# Altium schematic sheet drivers.SchDoc
size A1
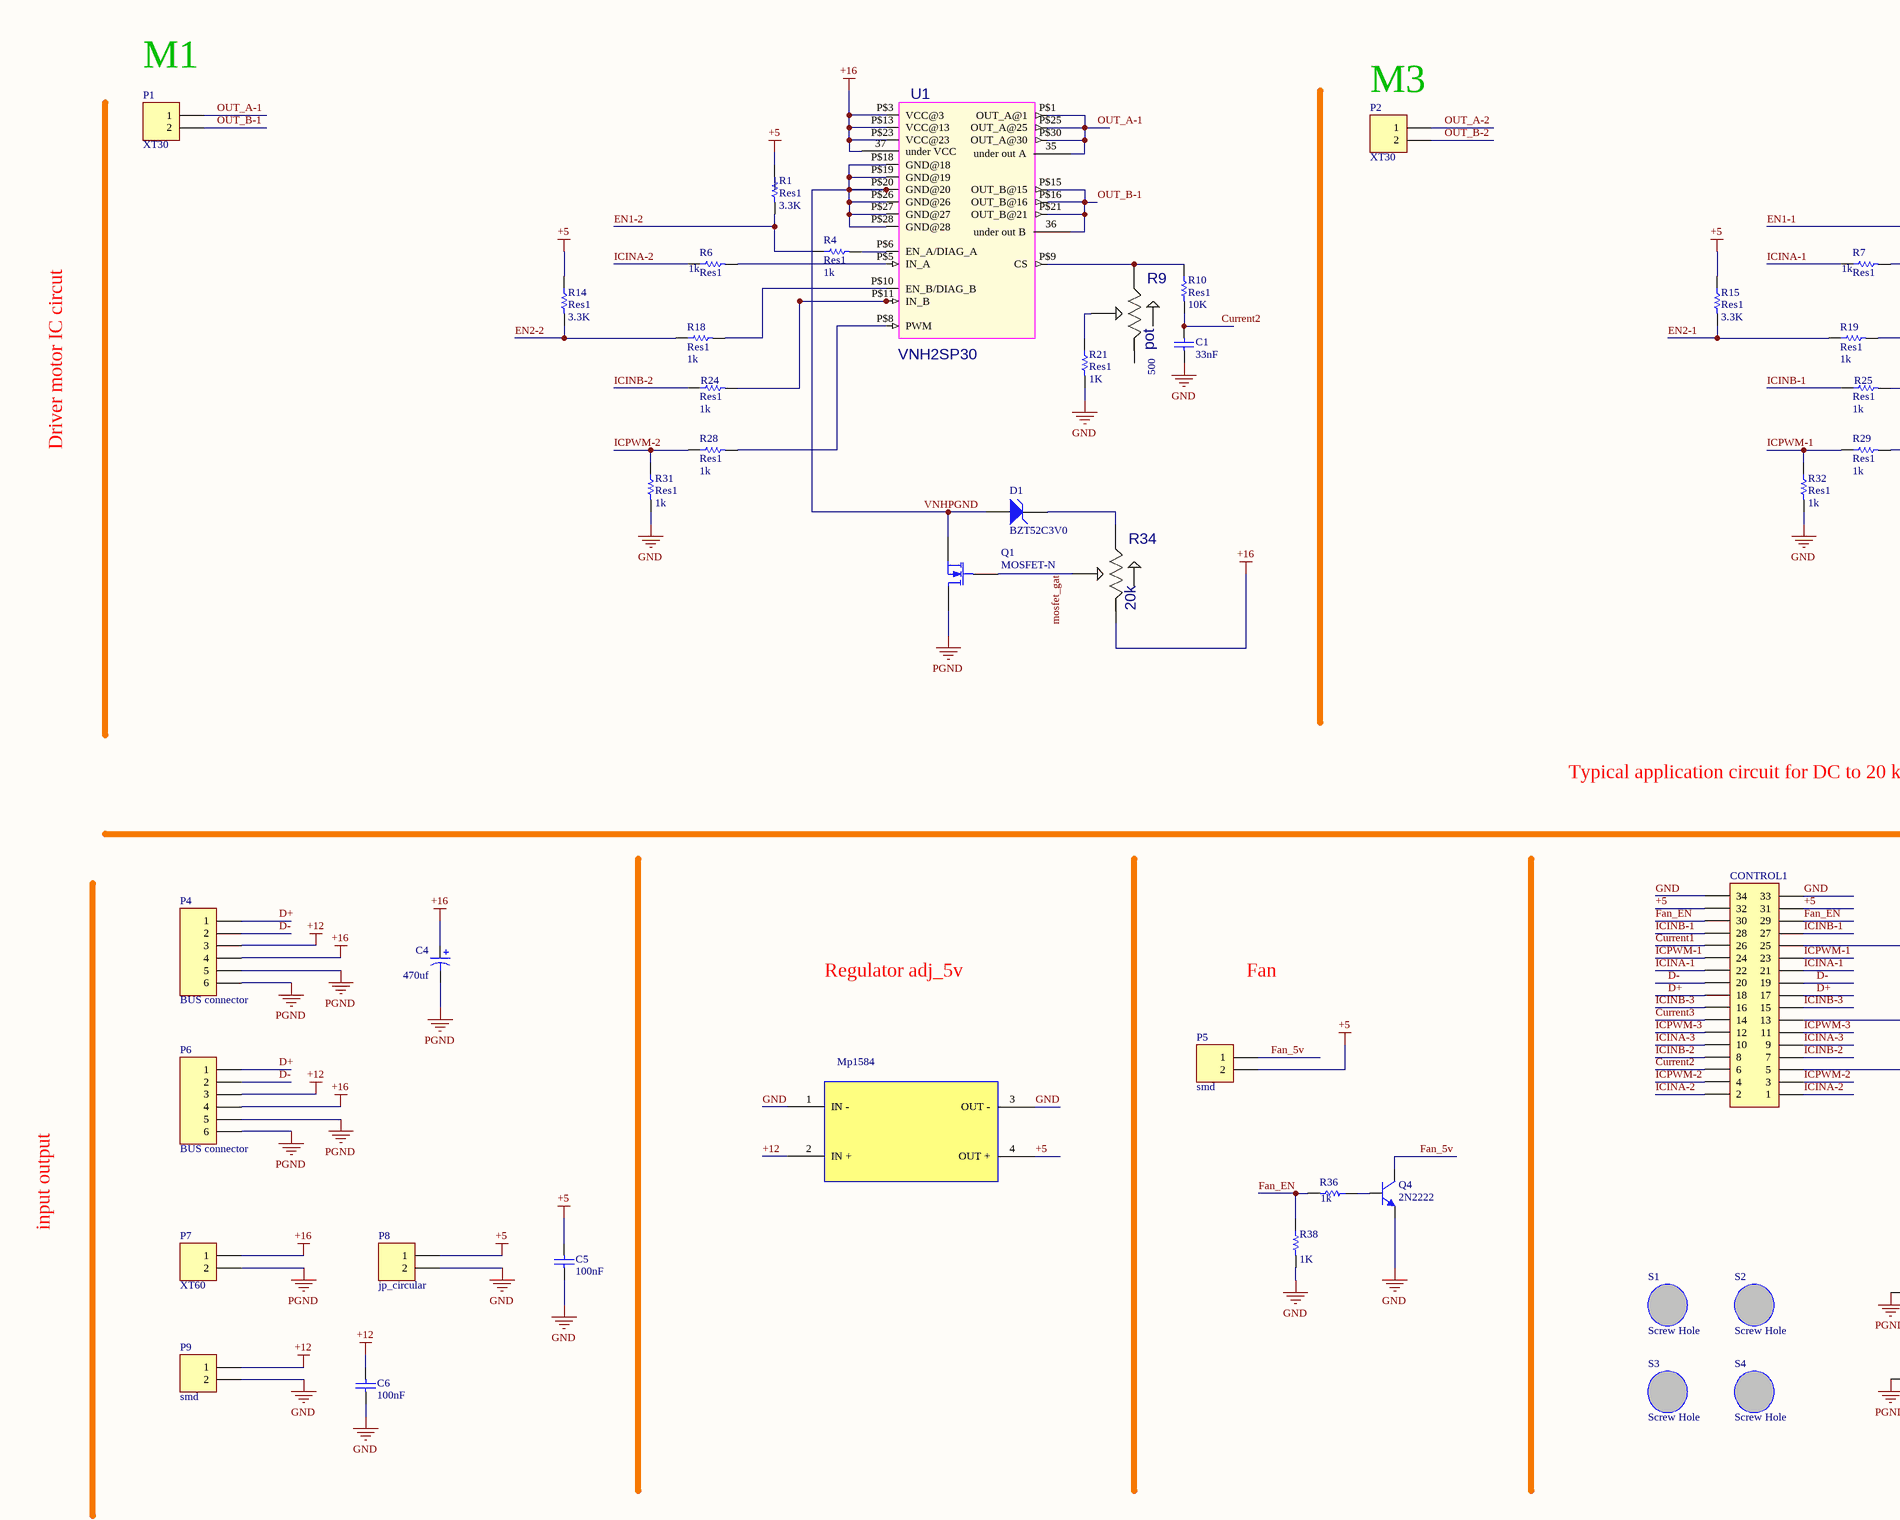
[diagram p0: drivers.SchDoc, left]
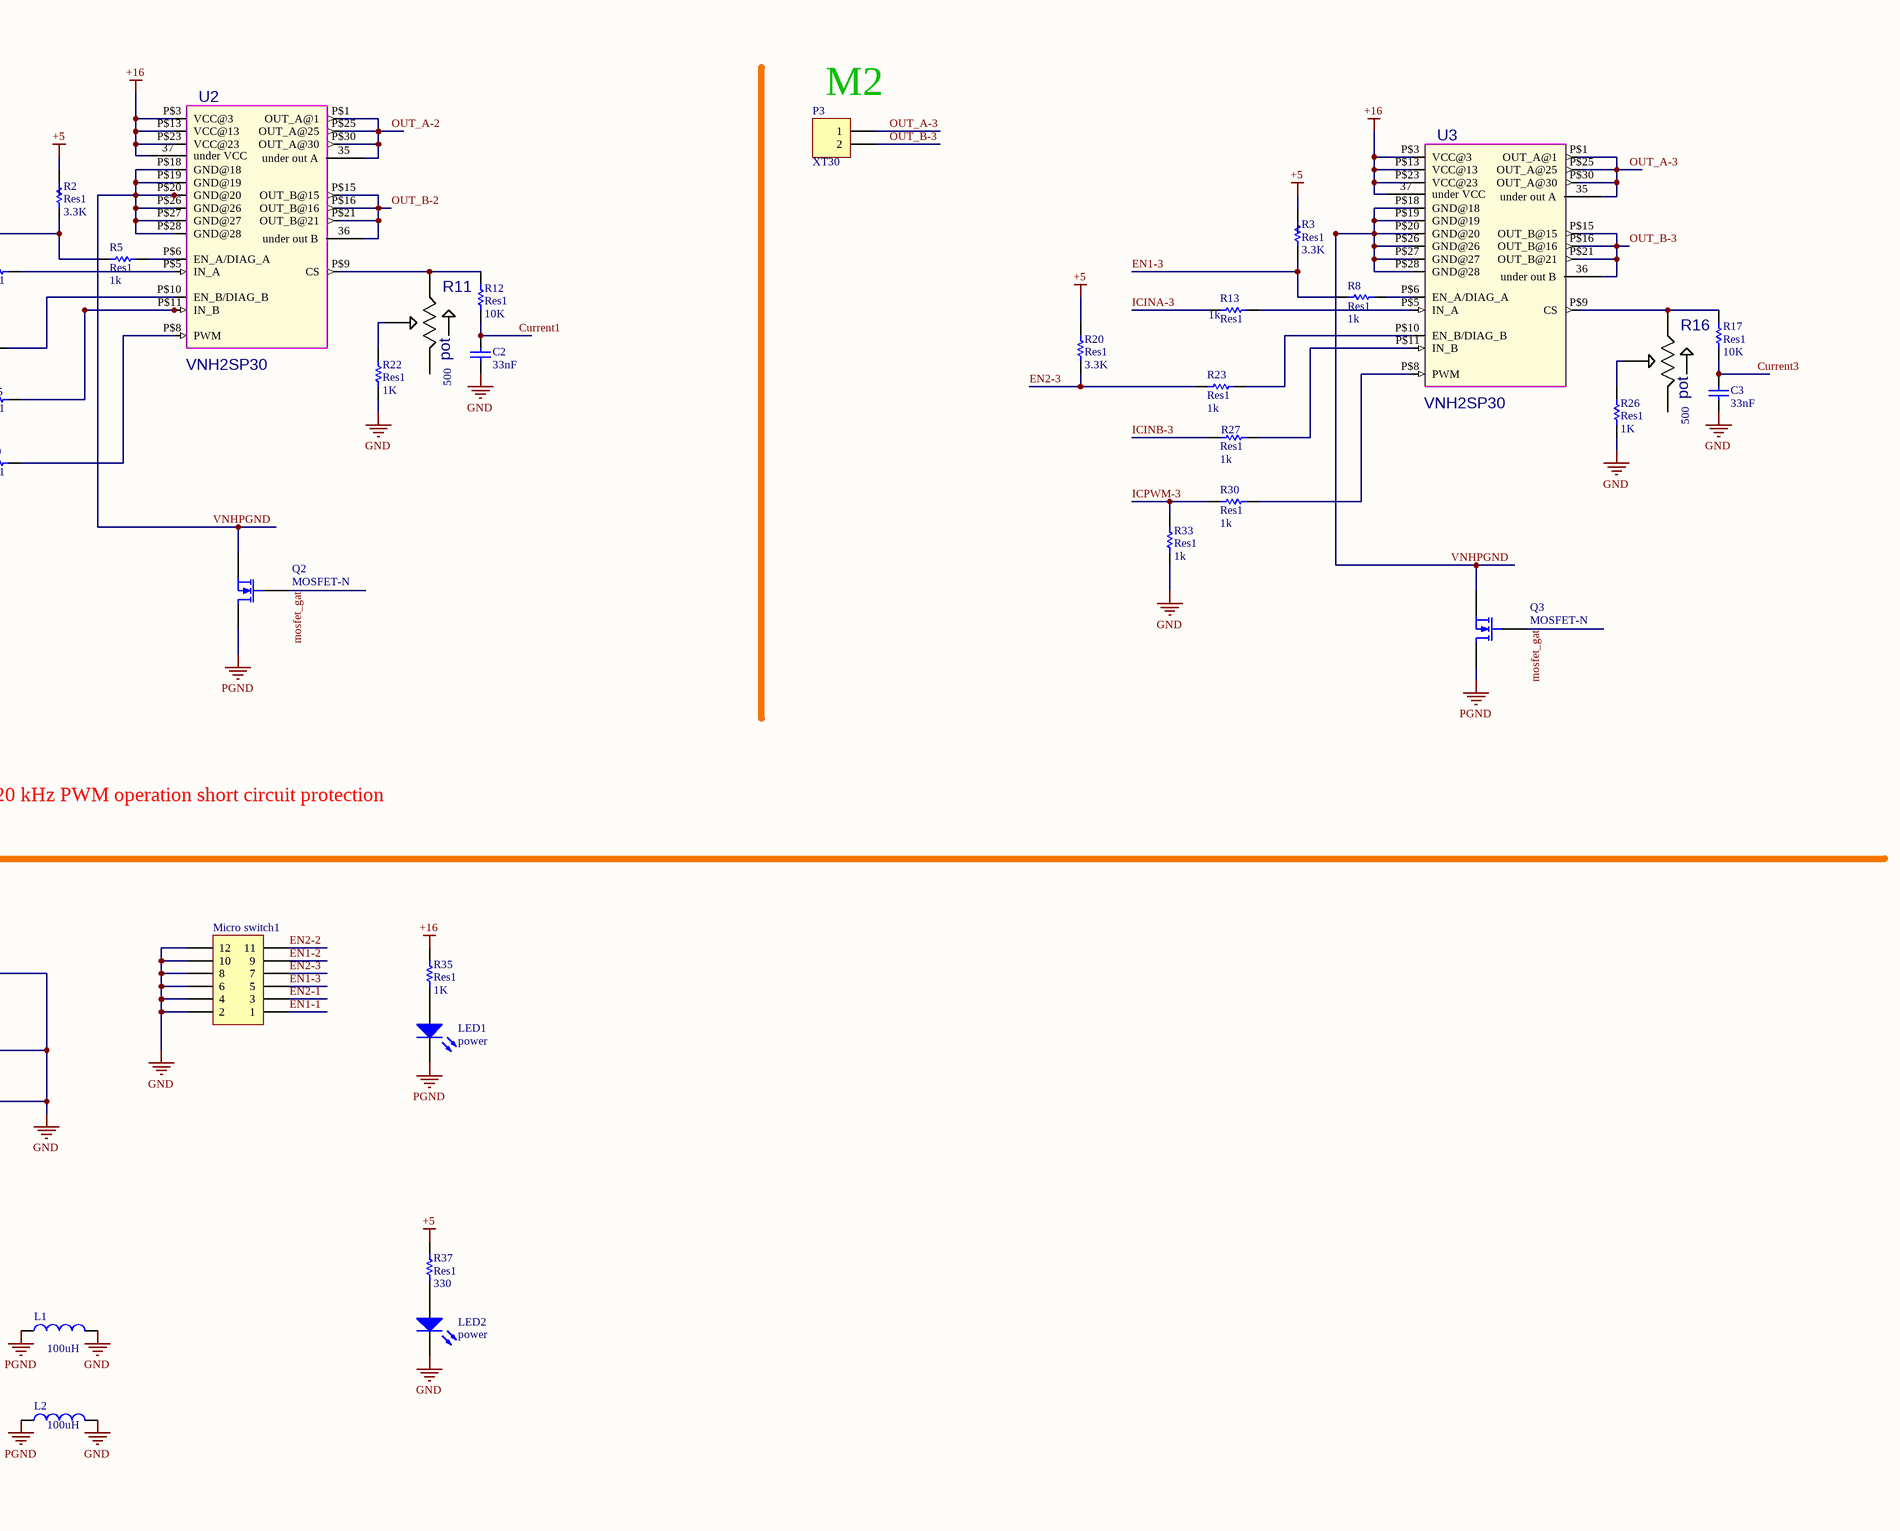
[diagram p1: drivers.SchDoc, right]

## Parts
C1  33nF  [J1-0603]
C2  33nF  [J1-0603]
C3  33nF  [J1-0603]
C4  value 470uf  [CAP 470uf sleep smd]  (hidden comment: Cap Pol1)
C5  100nF  [J1-0603]
C6  100nF  [J1-0603]
CONTROL1  (no value)  [HDR2X17H]
D1  BZT52C3V0  [SOD123]
L1  value 100uH  [2012[0805]]
L2  value 100uH  [2012[0805]]
LED1  power  [3518]
LED2  power  [3518]
Micro_switch1  (no value)  [HDR2X6H]
Mp1  Mp1584  [mp1584-1.8]
P1  XT30  [xt-30]
P2  XT30  [xt-30]
P3  XT30  [xt-30]
P4  BUS connector  [CON6-TIWAN]
P5  smd  [sheader 2]
P6  BUS connector  [con6-tiwan]
P7  XT60  [XT-60]
P8  jp_circular  [JP circular 2]
P9  smd  [sheader 2]
Q1  MOSFET-N  [D-pack]
Q2  MOSFET-N  [D-pack]
Q3  MOSFET-N  [D-pack]
Q4  2N2222  [SOT-23]
R1  Res1  value 3.3K  [j1-0603]
R2  Res1  value 3.3K  [j1-0603]
R3  Res1  value 3.3K  [j1-0603]
R4  Res1  value 1k  [j1-0603]
R5  Res1  value 1k  [j1-0603]
R6  Res1  value 1k  [j1-0603]
R7  Res1  value 1k  [j1-0603]
R8  Res1  value 1k  [j1-0603]
R9  pot  value 500  [35WR_TC33X-2-103E(Primary)]
R10  Res1  value 10K  [j1-0603]
R11  pot  value 500  [35WR_TC33X-2-103E(Primary)]
R12  Res1  value 10K  [j1-0603]
R13  Res1  value 1k  [j1-0603]
R14  Res1  value 3.3K  [j1-0603]
R15  Res1  value 3.3K  [j1-0603]
R16  pot  value 500  [35WR_TC33X-2-103E(Primary)]
R17  Res1  value 10K  [j1-0603]
R18  Res1  value 1k  [j1-0603]
R19  Res1  value 1k  [j1-0603]
R20  Res1  value 3.3K  [j1-0603]
R21  Res1  value 1K  [j1-0603]
R22  Res1  value 1K  [j1-0603]
R23  Res1  value 1k  [j1-0603]
R24  Res1  value 1k  [j1-0603]
R25  Res1  value 1k  [j1-0603]
R26  Res1  value 1K  [j1-0603]
R27  Res1  value 1k  [j1-0603]
R28  Res1  value 1k  [j1-0603]
R29  Res1  value 1k  [j1-0603]
R30  Res1  value 1k  [j1-0603]
R31  Res1  value 1k  [j1-0603]
R32  Res1  value 1k  [j1-0603]
R33  Res1  value 1k  [j1-0603]
R34  20k  [35WR_TC33X-2-103E(Primary)]
R35  Res1  value 1K  [j1-0603]
R36  value 1k  [j1-0603]
R37  Res1  value 330  [j1-0603]
R38  value 1K  [j1-0603]
S1  Screw Hole  [Screw Holw 3-6 mm]
S2  Screw Hole  [Screw Holw 3-6 mm]
S3  Screw Hole  [Screw Holw 3-6 mm]
S4  Screw Hole  [Screw Holw 3-6 mm]
U1  VNH2SP30  [MULTIPOWER30_VNH2SP30(Primary)]
U2  VNH2SP30  [MULTIPOWER30_VNH2SP30(Primary)]
U3  VNH2SP30  [MULTIPOWER30_VNH2SP30(Primary)]

## Nets
+5: C5.2 CONTROL1.31 CONTROL1.32 Mp1.4(OUT_+) P5.2 P8.1 R1.1 R2.1 R3.1 R14.1 R15.1 R20.1 R37.1
+12: C6.2 Mp1.2(IN_+) P4.3 P6.3 P9.1
+16: C4.1 P4.4 P6.4 P7.1 R34.1 R35.1 U1.37(under_VCC) U1.P$3(VCC@3) U1.P$13(VCC@13) U1.P$23(VCC@23) U2.37(under_VCC) U2.P$3(VCC@3) U2.P$13(VCC@13) U2.P$23(VCC@23) U3.37(under_VCC) U3.P$3(VCC@3) U3.P$13(VCC@13) U3.P$23(VCC@23)
GND: C1.1 C2.1 C3.1 C5.1 C6.1 CONTROL1.5 CONTROL1.13 CONTROL1.25 CONTROL1.33 CONTROL1.34 L1.2 L2.2 LED2.2(K) Micro_switch1.2 Micro_switch1.4 Micro_switch1.6 Micro_switch1.8 Micro_switch1.10 Micro_switch1.12 Mp1.1(IN_-) Mp1.3(OUT_-) P8.2 P9.2 Q4.3(E) R21.2 R22.2 R26.2 R31.2 R32.2 R33.2 R38.2
PGND: C4.2 L1.1 L2.1 LED1.2(K) P4.5 P4.6 P6.5 P6.6 P7.2 Q1.2(D) Q2.2(D) Q3.2(D)
Current1: C2.2 CONTROL1.26 R12.2
Current2: C1.2 CONTROL1.6 R10.2
Current3: C3.2 CONTROL1.14 R17.2
D+: CONTROL1.17 CONTROL1.18 P4.1 P6.1
D-: CONTROL1.19 CONTROL1.20 P4.2 P6.2
EN1-1: D1.1(A) Micro_switch1.1 Micro_switch1.5 Micro_switch1.9 Q1.3(S) Q2.3(S) Q3.3(S) R1.2 R2.2 R3.2 R4.1 R5.1 R8.1 U1.P$18(GND@18) U1.P$19(GND@19) U1.P$20(GND@20) U1.P$26(GND@26) U1.P$27(GND@27) U1.P$28(GND@28) U2.P$18(GND@18) U2.P$19(GND@19) U2.P$20(GND@20) U2.P$26(GND@26) U2.P$27(GND@27) U2.P$28(GND@28) U3.P$18(GND@18) U3.P$19(GND@19) U3.P$20(GND@20) U3.P$26(GND@26) U3.P$27(GND@27) U3.P$28(GND@28)  [also labelled EN1-2, EN1-3, VNHPGND]
EN2-1: Micro_switch1.3 R15.2 R19.1
EN2-2: Micro_switch1.11 R14.2 R18.1
EN2-3: Micro_switch1.7 R20.2 R23.1
Fan_5v: P5.1 Q4.1(C)
Fan_EN: CONTROL1.29 CONTROL1.30 R36.2 R38.1
ICINA-1: CONTROL1.21 CONTROL1.22 R7.1
ICINA-2: CONTROL1.1 CONTROL1.2 R6.1
ICINA-3: CONTROL1.9 CONTROL1.10 R13.1
ICINB-1: CONTROL1.27 CONTROL1.28 R25.1
ICINB-2: CONTROL1.7 CONTROL1.8 R24.1
ICINB-3: CONTROL1.15 CONTROL1.16 R27.1
ICPWM-1: CONTROL1.23 CONTROL1.24 R29.1 R32.1
ICPWM-2: CONTROL1.3 CONTROL1.4 R28.1 R31.1
ICPWM-3: CONTROL1.11 CONTROL1.12 R30.1 R33.1
mosfet_gat: Q1.1(G) Q2.1(G) Q3.1(G) R34.2
OUT_A-1: P1.1 U1.35(under_out_A) U1.P$1(OUT_A@1) U1.P$25(OUT_A@25) U1.P$30(OUT_A@30)
OUT_A-2: P2.1 U2.35(under_out_A) U2.P$1(OUT_A@1) U2.P$25(OUT_A@25) U2.P$30(OUT_A@30)
OUT_A-3: P3.1 U3.35(under_out_A) U3.P$1(OUT_A@1) U3.P$25(OUT_A@25) U3.P$30(OUT_A@30)
OUT_B-1: P1.2 U1.36(under_out_B) U1.P$15(OUT_B@15) U1.P$16(OUT_B@16) U1.P$21(OUT_B@21)
OUT_B-2: P2.2 U2.36(under_out_B) U2.P$15(OUT_B@15) U2.P$16(OUT_B@16) U2.P$21(OUT_B@21)
OUT_B-3: P3.2 U3.36(under_out_B) U3.P$15(OUT_B@15) U3.P$16(OUT_B@16) U3.P$21(OUT_B@21)
NetD1_2: D1.2(K) R34.3
NetLED1_1: LED1.1(A) R35.2
NetLED2_1: LED2.1(A) R37.2
NetQ4_2: Q4.2(B) R36.1
NetR4_2: R4.2 U1.P$6(EN_A/DIAG_A)
NetR5_2: R5.2 U2.P$6(EN_A/DIAG_A)
NetR6_2: R6.2 U1.P$5(IN_A)
NetR7_2: R7.2 U2.P$5(IN_A)
NetR8_2: R8.2 U3.P$6(EN_A/DIAG_A)
NetR9_2: R9.2 R21.1
NetR9_3: R9.3 R10.1 U1.P$9(CS)
NetR11_2: R11.2 R22.1
NetR11_3: R11.3 R12.1 U2.P$9(CS)
NetR13_2: R13.2 U3.P$5(IN_A)
NetR16_2: R16.2 R26.1
NetR16_3: R16.3 R17.1 U3.P$9(CS)
NetR18_2: R18.2 U1.P$10(EN_B/DIAG_B)
NetR19_2: R19.2 U2.P$10(EN_B/DIAG_B)
NetR23_2: R23.2 U3.P$10(EN_B/DIAG_B)
NetR24_2: R24.2 U1.P$11(IN_B)
NetR25_2: R25.2 U2.P$11(IN_B)
NetR27_2: R27.2 U3.P$11(IN_B)
NetR28_2: R28.2 U1.P$8(PWM)
NetR29_2: R29.2 U2.P$8(PWM)
NetR30_2: R30.2 U3.P$8(PWM)

Not connected (* = marked no-connect by the designer): R9 1; R11 1; R16 1

## Notes on the sheet
- (near P1) M1
- (near P2) M3
- (near P3) M2
- Driver motor IC circut
- Typical application circuit for DC to 20 kHz PWM operation short circuit protection
- Regulator adj_5v
- Fan
- input output

## Library data of the parts
C1-C3 = Cap: Capacitor; Value: 100nF; Published: 8-Jun-2000; LatestRevisionDate: 17-Jul-2002; LatestRevisionNote: Re-released for DXP Platform.; PackageReference: RAD-0.3; Publisher: Altium Limited
C4 = Cap Pol1: Polarized Capacitor (Radial); Published: 8-Jun-2000; LatestRevisionDate: 17-Jul-2002; LatestRevisionNote: Re-released for DXP Platform.; PackageReference: RB7.6-15; Publisher: Altium Limited
C5 C6 = Cap: Capacitor; Published: 8-Jun-2000; LatestRevisionDate: 17-Jul-2002; LatestRevisionNote: Re-released for DXP Platform.; PackageReference: RAD-0.3; Publisher: Altium Limited; Value: 100nF
CONTROL1 = Header 17X2H: Header, 17-Pin, Dual row, Right Angle; LatestRevisionDate: 17-Jul-2002; LatestRevisionNote: Re-released for DXP Platform.; Publisher: Altium Limited
D1 = BZT52C3V0: Surface Mount Zener Diode; Published: 8-Jun-2000; LatestRevisionDate: 17-Jul-2002; LatestRevisionNote: Re-released for DXP Platform.; DatasheetDocument: REV. L-2; PackageReference: SOD-123; Publisher: Altium Limited; ComponentLink1Description: Manufacturer Link; ComponentLink1URL: http://www.vishay.com/
L1 L2 = Inductor: Manufacturer: Generic Components; Class: Passive; Published: 08/06/2000; Publisher: Altium Hobart Technology Centre; SubClass: Inductor
LED1 LED2 = LED3: Typical BLUE SiC LED; pin to pad: 1>2 2>1; Published: 8-Jun-2000; LatestRevisionDate: 17-Dec-2003; LatestRevisionNote: PCB Footprint replaced.; DatasheetDocument: 16-Apr-2002; PackageDocument: 16-Apr-2002; PackageReference: 3.5X2.8X1.9; Publisher: Altium Limited
Micro_switch1 = Header 6X2H: Header, 6-Pin, Dual row, Right Angle; LatestRevisionDate: 17-Jul-2002; LatestRevisionNote: Re-released for DXP Platform.; Publisher: Altium Limited
P1-P3 = Header 2: Header, 2-Pin; pin to pad: 1>- 2>+; LatestRevisionDate: 17-Jul-2002; LatestRevisionNote: Re-released for DXP Platform.; Publisher: Altium Limited
P4 P6 = Header 6: Header, 6-Pin; LatestRevisionDate: 17-Jul-2002; LatestRevisionNote: Re-released for DXP Platform.; Publisher: Altium Limited
P5 P9 = Header 2: Header, 2-Pin; LatestRevisionDate: 17-Jul-2002; LatestRevisionNote: Re-released for DXP Platform.; Publisher: Altium Limited
P7 = Header 2: Header, 2-Pin; pin to pad: 1>+ 2>-; LatestRevisionDate: 17-Jul-2002; LatestRevisionNote: Re-released for DXP Platform.; Publisher: Altium Limited
P8 = Header 2: Header, 2-Pin; pin to pad: 1>2 2>1; LatestRevisionDate: 17-Jul-2002; LatestRevisionNote: Re-released for DXP Platform.; Publisher: Altium Limited
Q1-Q3 = MOSFET-N: N-Channel MOSFET; pin to pad: 2>4; PackageDocument: 1995/1996; Published: 8-Jun-2000; LatestRevisionDate: 17-Jul-2002; LatestRevisionNote: Re-released for DXP Platform.; PackageReference: E3; Publisher: Altium Limited
Q4 = 2N2222: NPN Bipolar Transistor; Published: 8-Jun-2000; LatestRevisionDate: 17-Jul-2002; LatestRevisionNote: Re-released for DXP Platform.; PackageReference: TO-226; Publisher: Altium Limited; Code_JEDEC: TO-226-AA
R1-R8 R10 R12-R15 R17-R33 R35 R37 = Res1: Resistor; Published: 8-Jun-2000; LatestRevisionDate: 17-Jul-2002; LatestRevisionNote: Re-released for DXP Platform.; PackageReference: AXIAL-0.3; Publisher: Altium Limited
R9 R11 R16 R34 = TC33X-2-103E: pin to pad: 2>3 3>2
  R34: Value: *
R36 R38 = Res1: Resistor; Manufacturer: Generic Components; Class: Passive; Published: 08/06/2000; Publisher: Altium Hobart Technology Centre; SubClass: Resistor
U1-U3 = VNH2SP30: Dip18; MF: STMicroelectronics; Availability: Unavailable; Price: None; MP: VNH2SP30; Value: *